# Altium project 切割板PCB_Project.PrjPcb
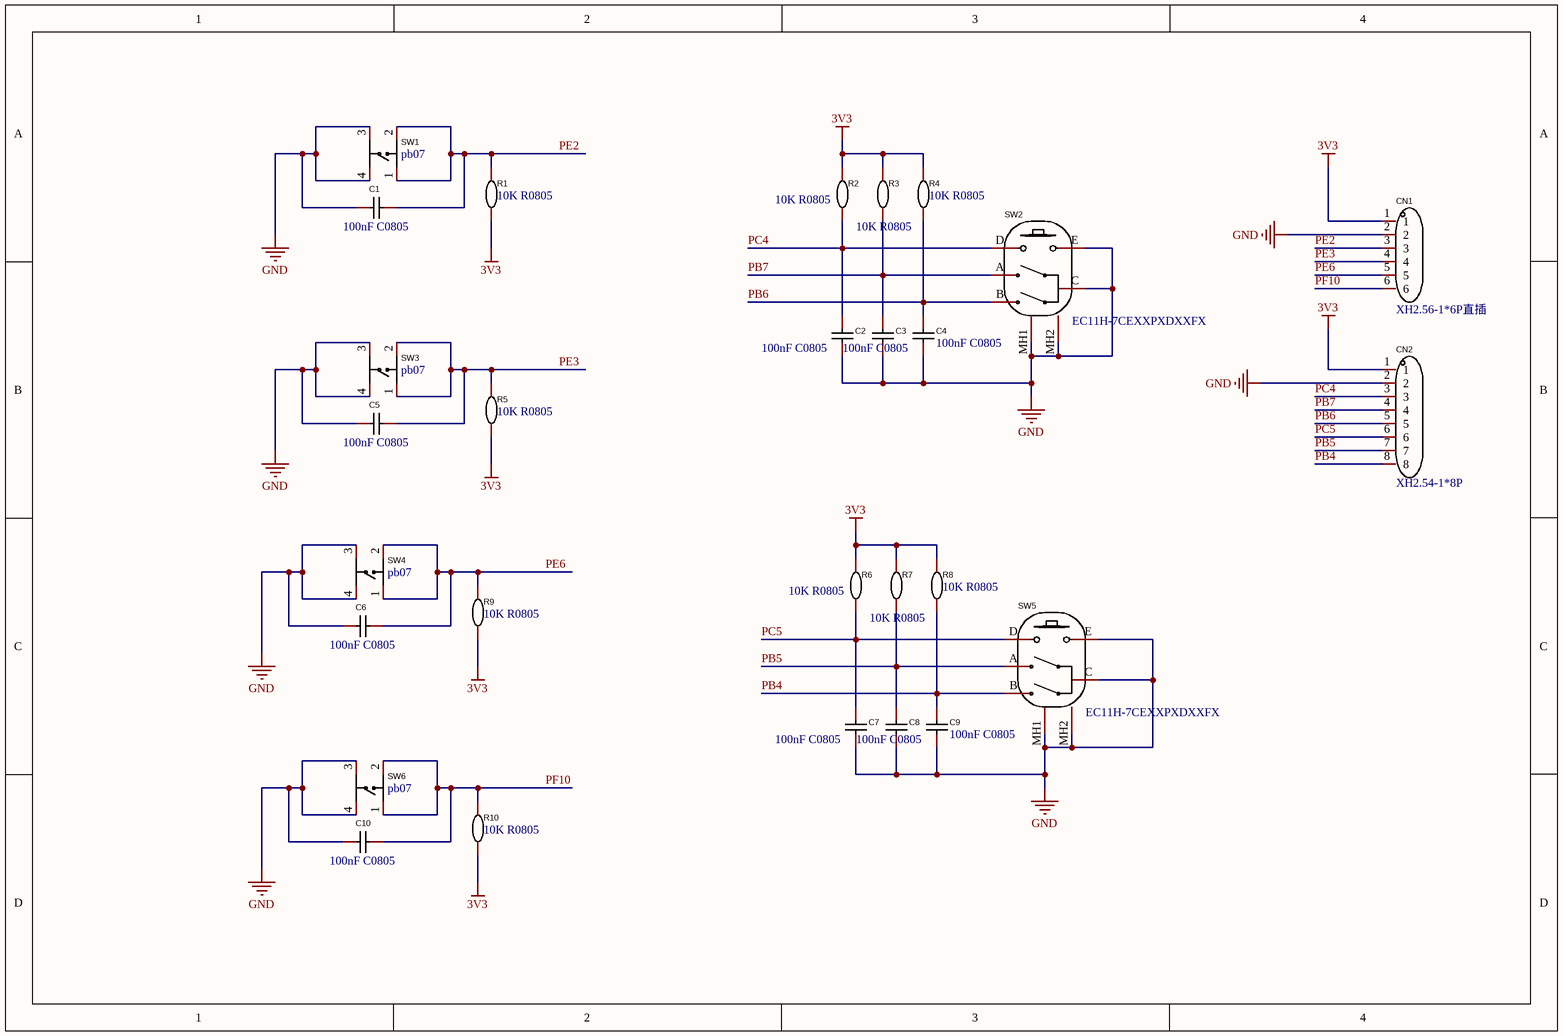
[diagram p0: Sheet1.SchDoc]
2 sheets, 34 parts. Net scope: global (net labels, ports and power ports of the same name join across sheets).
Board files: PCB1.PcbDoc, 按键（修改后）.PcbDoc, POCOPIN线板.PcbDoc, PCB4.PcbDoc
Sheets:
  Sheet1.SchDoc
  pocopin.SchDoc

## Sheet Sheet1.SchDoc
size A4

### Parts
C1  100nF C0805  [C0805]
C2  100nF C0805  [C0805]
C3  100nF C0805  [C0805]
C4  100nF C0805  [C0805]
C5  100nF C0805  [C0805]
C6  100nF C0805  [C0805]
C7  100nF C0805  [C0805]
C8  100nF C0805  [C0805]
C9  100nF C0805  [C0805]
C10  100nF C0805  [C0805]
CN1  XH2.56-1*6P直插  [H2.54-1*6P-直插CONN-TH_6P-P2.50_HC-XH-6A-G]
CN2  XH2.54-1*8P  [XH2.54-1*8P-CONN-TH_8P-P2.50_HC-XH-8A-G]
R1  10K R0805  [R0805]
R2  10K R0805  [R0805]
R3  10K R0805  [R0805]
R4  10K R0805  [R0805]
R5  10K R0805  [R0805]
R6  10K R0805  [R0805]
R7  10K R0805  [R0805]
R8  10K R0805  [R0805]
R9  10K R0805  [R0805]
R10  10K R0805  [R0805]
SW1  pb07  [KEY-pb07-5.08*5.08]
SW2  EC11H-7CEXXPXDXXFX  [旋转编码器-有焊盘修改SW-TH_EC11K1524406]
SW3  pb07  [KEY-pb07-5.08*5.08]
SW4  pb07  [KEY-pb07-5.08*5.08]
SW5  EC11H-7CEXXPXDXXFX  [旋转编码器-有焊盘修改SW-TH_EC11K1524406]
SW6  pb07  [KEY-pb07-5.08*5.08]

### Nets
3V3: CN1.1 CN2.1 R1.1 R2.2 R3.2 R4.2 R5.1 R6.2 R7.2 R8.2 R9.1 R10.1
GND: C1.1 C2.1 C3.1 C4.1 C5.1 C6.1 C7.1 C8.1 C9.1 C10.1 CN1.2 CN2.2 SW1.3 SW1.4 SW2.C SW2.E SW2.MH1 SW2.MH2 SW3.3 SW3.4 SW4.3 SW4.4 SW5.C SW5.E SW5.MH1 SW5.MH2 SW6.3 SW6.4
PB4: C9.2 CN2.8 R8.1 SW5.B
PB5: C8.2 CN2.7 R7.1 SW5.A
PB6: C4.2 CN2.5 R4.1 SW2.B
PB7: C3.2 CN2.4 R3.1 SW2.A
PC4: C2.2 CN2.3 R2.1 SW2.D
PC5: C7.2 CN2.6 R6.1 SW5.D
PE2: C1.2 CN1.3 R1.2 SW1.1 SW1.2
PE3: C5.2 CN1.4 R5.2 SW3.1 SW3.2
PE6: C6.2 CN1.5 R9.2 SW4.1 SW4.2
PF10: C10.2 CN1.6 R10.2 SW6.1 SW6.2

### Library data of the parts
C1-C10 = C0805: Manufacturer: SAMSUNG(三星); Name: 10uF; Symbol: CL21A106KAYNNNE; Device: CL21A106KAYNNNE_C15850; Add into BOM: yes; Value: 10uF; Tolerance: ±10%; Voltage Rated: 25V; Temperature Coefficient: X5R; LCSC Part Name: 10uF ±10% 25V; Supplier Part: C15850; Manufacturer Part: CL21A106KAYNNNE; Supplier Footprint: 0805; JLCPCB Part Class: Basic Part; Datasheet: https://atta.szlcsc.com/upload/public/pdf/source/20160103/1457707679302.pdf; Supplier: LCSC; Convert to PCB: yes
CN1 = XH2.56-1*6P直插: Manufacturer: HCTL(华灿天禄); Name: HC-XH-6AW-G; Add into BOM: yes; Reference Series: XH; Pitch: 2.54mm; Pins Structure: 1x6P; Number of PINs Per Row: 6; Gender: 公型插针; Current Rating (Max): 3A; Symbol: HC-XH-6AW-G; Device: HC-XH-6AW-G; LCSC Part Name: XH 2.54mm 1x6P 弯插; Supplier Part: C5341212; Manufacturer Part: HC-XH-6AW-G; Supplier Footprint: 弯插,P=2.5mm; Datasheet: https://atta.szlcsc.com/upload/public/pdf/source/20230105/4FFD2EFD3DA44AA828171A44400F3EDE.pdf; Supplier: LCSC; Convert to PCB: yes; Number of Rows: 1; Row Spacing: 2.54mm; Mounting Style: 弯插; Operating Temperature Range: -25℃~+85℃
CN2 = XH2.54-1*8P: XH2.54-1*8P//直插//C5341207; Manufacturer: HCTL(华灿天禄); Name: HC-XH-8A-G; Add into BOM: yes; Reference Series: XH; Pitch: 2.54mm; Pins Structure: 1x8P; Number of PINs Per Row: 8; Gender: 公型插针; Current Rating (Max): 3A; Symbol: HC-XH-8A-G; Device: HC-XH-8A-G; LCSC Part Name: 2.5mm 1x8P 直插; Supplier Part: C5341207; Manufacturer Part: HC-XH-8A-G; Supplier Footprint: 直插,P=2.5mm; JLCPCB Part Class: Extended Part; Datasheet: https://atta.szlcsc.com/upload/public/pdf/source/20230105/4FFD2EFD3DA44AA828171A44400F3EDE.pdf; Supplier: LCSC; Convert to PCB: yes; Number of Rows: 1; Row Spacing: 2.54mm; Mounting Style: 直插; Operating Temperature Range: -25℃~+85℃
R1-R10 = R0805: Manufacturer: UNI-ROYAL(厚声); Name: 10kΩ; Symbol: 0805W8F1002T5E; Device: 0805W8F1002T5E_C17414; Add into BOM: yes; Tolerance: ±1%; Temperature Coefficient: ±100ppm/℃; Value: 10kΩ; Power(Watts): 1/8W; Overload Voltage (Max): 150V; LCSC Part Name: 10KΩ ±1%; Supplier Part: C17414; Manufacturer Part: 0805W8F1002T5E; Supplier Footprint: 0805; JLCPCB Part Class: Basic Part; Datasheet: https://atta.szlcsc.com/upload/public/pdf/source/20170920/C17414_1505887067106979773.pdf; Supplier: LCSC; Convert to PCB: yes; Operating Temperature Range: -55℃~+155℃
SW1 SW3 SW4 SW6 = pb07: pb07无声轻触按键//东莞市荣硕电子; Manufacturer: Yuandi(元迪); Name: TS-1095PD-A9B3-D2; Add into BOM: yes; Symbol: TS-1095PD-A9B3-D2; Device: TS-1095PD-A9B3-D2; LCSC Part Name: 6*6*8.0四脚插件正按黑柄DIP按键250gf; Supplier Part: C2834903; Manufacturer Part: TS-1095PD-A9B3-D2; Supplier Footprint: 插件,6x6x8mm; JLCPCB Part Class: Extended Part; Datasheet: https://atta.szlcsc.com/upload/public/pdf/source/20210520/C2834872_7B734042F4AFC186C436C08E153ADB00.pdf; Supplier: LCSC; Convert to PCB: yes
SW2 SW5 = EC11H-7CEXXPXDXXFX: EC11H-7CEXXPXDXXFX//宏彦科技; Manufacturer: ALPSALPINE(阿尔卑斯阿尔派); Name: EC11K1524406; Add into BOM: yes; Symbol: EC11K1524406; Device: EC11K1524406; LCSC Part Name: 编码器; Supplier Part: C398934; Manufacturer Part: EC11K1524406; Supplier Footprint: 插件; JLCPCB Part Class: Extended Part; Datasheet: https://atta.szlcsc.com/upload/public/pdf/source/20190620/C398934_DDD5BF6D843226194F24C74B1929B82F.pdf; Supplier: LCSC; Convert to PCB: yes

## Sheet pocopin.SchDoc
size A4
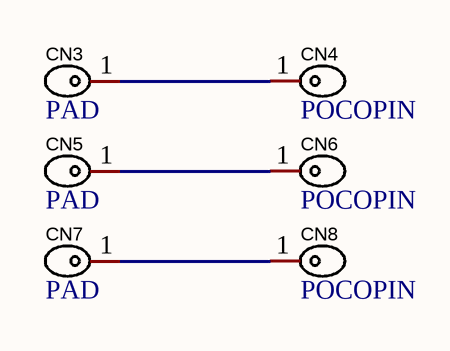
[diagram p1: pocopin.SchDoc]

### Parts
CN3  PAD  [PAD]
CN4  POCOPIN  [pocopin焊盘]
CN5  PAD  [PAD]
CN6  POCOPIN  [pocopin焊盘]
CN7  PAD  [PAD]
CN8  POCOPIN  [pocopin焊盘]

### Nets
NetCN3_1: CN3.1 CN4.1
NetCN5_1: CN5.1 CN6.1
NetCN7_1: CN7.1 CN8.1

### Library data of the parts
CN3 CN5 CN7 = PAD: Manufacturer: YIYUAN(怡远); Name: YTC1P-3015-01; Add into BOM: yes; Overall Length/Height: 4.5mm; Rated Current: 2.5A; Rated Voltage: 12V; Symbol: YTC1P-3015-01; Device: YTC1P-3015-01; LCSC Part Name: POGO PIN弹簧顶针 贴片连接器; Supplier Part: C5221293; Manufacturer Part: YTC1P-3015-01; Supplier Footprint: -; JLCPCB Part Class: Extended Part; Datasheet: https://atta.szlcsc.com/upload/public/pdf/source/20221031/BD070516233C1C93A35D01CFB419D0D5.pdf; Supplier: LCSC; Convert to PCB: yes; Type: 弹簧顶针(POGO PIN); Number of Pins: 单PIN位; Contact Material: 黄铜; Contact Plating: 金
CN4 CN6 CN8 = POCOPIN: Manufacturer: YIYUAN(怡远); Name: YTC1P-3015-01; Add into BOM: yes; Overall Length/Height: 4.5mm; Rated Current: 2.5A; Rated Voltage: 12V; Symbol: YTC1P-3015-01; Device: YTC1P-3015-01; LCSC Part Name: POGO PIN弹簧顶针 贴片连接器; Supplier Part: C5221293; Manufacturer Part: YTC1P-3015-01; Supplier Footprint: -; JLCPCB Part Class: Extended Part; Datasheet: https://atta.szlcsc.com/upload/public/pdf/source/20221031/BD070516233C1C93A35D01CFB419D0D5.pdf; Supplier: LCSC; Convert to PCB: yes; Type: 弹簧顶针(POGO PIN); Number of Pins: 单PIN位; Contact Material: 黄铜; Contact Plating: 金